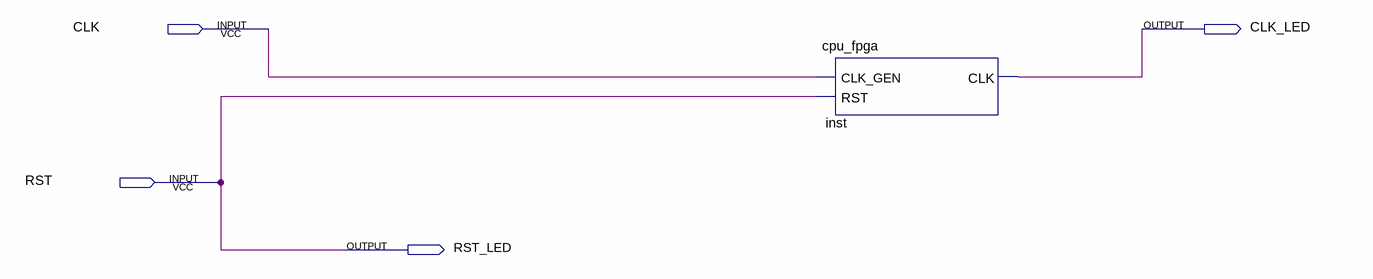
[diagram p0: schematic sheet]
// Quartus schematic TopLevel.bdf as structural Verilog: 1 symbols, 4 pins
module TopLevel (
  input  CLK,
  input  RST,
  output CLK_LED,
  output RST_LED
);

  cpu_fpga inst (.CLK_GEN(CLK), .RST(RST), .CLK(CLK_LED));

  assign RST_LED = RST;
endmodule
